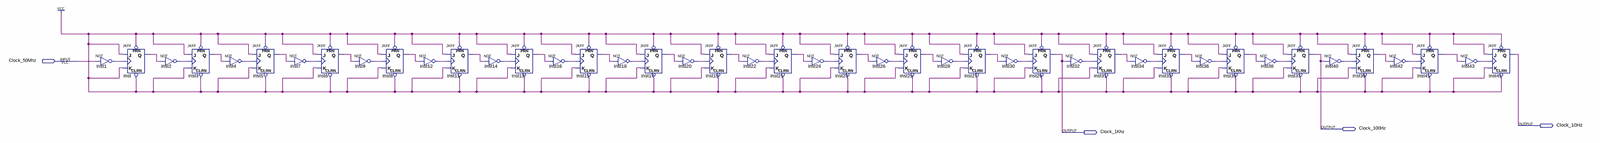
[diagram p0: schematic sheet, whole]
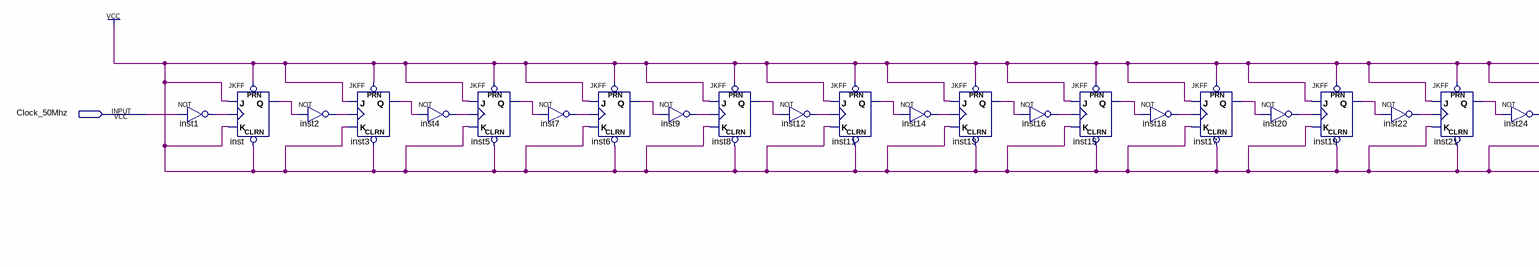
[diagram p1: schematic sheet, left part]
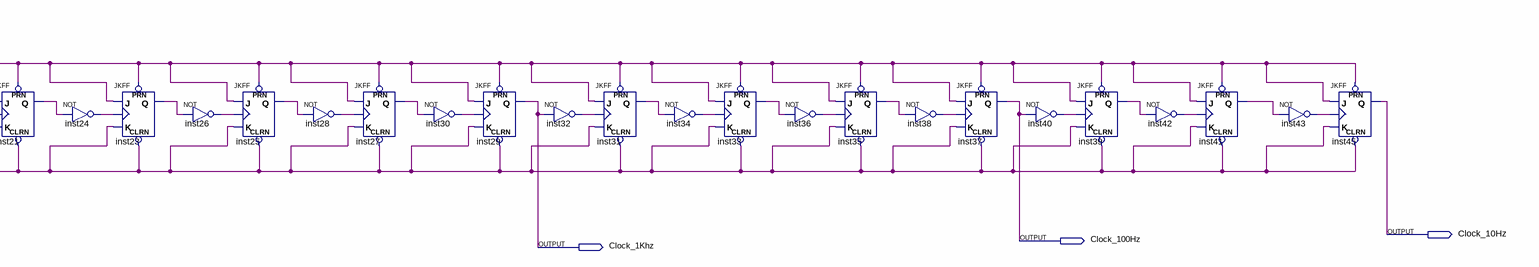
[diagram p2: schematic sheet, right part]
// Quartus schematic Clock.bdf as structural Verilog: 44 symbols, 4 pins
module Clock (
  input  Clock_50Mhz,
  output Clock_10Hz,
  output Clock_100Hz,
  output Clock_1Khz
);

  wire inst1_out, inst2_out, inst3_q, inst4_out, inst5_q, inst6_q, inst7_out, inst8_q, inst9_out, inst11_q,
       inst12_out, inst13_q, inst14_out, inst15_q, inst16_out, inst17_q, inst18_out, inst19_q, inst20_out,
       inst21_q, inst22_out, inst23_q, inst24_out, inst25_q, inst26_out, inst27_q, inst28_out, inst30_out,
       inst31_q, inst32_out, inst33_q, inst34_out, inst35_q, inst36_out, inst38_out, inst39_q, inst40_out,
       inst41_q, inst42_out, inst43_out, inst_q;

  not inst1 (inst1_out, Clock_50Mhz);
  JKFF inst (.PRN(1'b1), .CLRN(1'b1), .K(1'b1), .J(1'b1), .CLK(inst1_out), .Q(inst_q));
  not inst2 (inst2_out, inst_q);
  JKFF inst3 (.PRN(1'b1), .CLRN(1'b1), .K(1'b1), .J(1'b1), .CLK(inst2_out), .Q(inst3_q));
  not inst4 (inst4_out, inst3_q);
  JKFF inst5 (.PRN(1'b1), .CLRN(1'b1), .K(1'b1), .J(1'b1), .CLK(inst4_out), .Q(inst5_q));
  not inst7 (inst7_out, inst5_q);
  JKFF inst6 (.PRN(1'b1), .CLRN(1'b1), .K(1'b1), .J(1'b1), .CLK(inst7_out), .Q(inst6_q));
  not inst9 (inst9_out, inst6_q);
  JKFF inst8 (.PRN(1'b1), .CLRN(1'b1), .K(1'b1), .J(1'b1), .CLK(inst9_out), .Q(inst8_q));
  not inst12 (inst12_out, inst8_q);
  JKFF inst11 (.PRN(1'b1), .CLRN(1'b1), .K(1'b1), .J(1'b1), .CLK(inst12_out), .Q(inst11_q));
  not inst14 (inst14_out, inst11_q);
  JKFF inst13 (.PRN(1'b1), .CLRN(1'b1), .K(1'b1), .J(1'b1), .CLK(inst14_out), .Q(inst13_q));
  not inst16 (inst16_out, inst13_q);
  JKFF inst15 (.PRN(1'b1), .CLRN(1'b1), .K(1'b1), .J(1'b1), .CLK(inst16_out), .Q(inst15_q));
  not inst18 (inst18_out, inst15_q);
  JKFF inst17 (.PRN(1'b1), .CLRN(1'b1), .K(1'b1), .J(1'b1), .CLK(inst18_out), .Q(inst17_q));
  not inst20 (inst20_out, inst17_q);
  JKFF inst19 (.PRN(1'b1), .CLRN(1'b1), .K(1'b1), .J(1'b1), .CLK(inst20_out), .Q(inst19_q));
  not inst22 (inst22_out, inst19_q);
  JKFF inst21 (.PRN(1'b1), .CLRN(1'b1), .K(1'b1), .J(1'b1), .CLK(inst22_out), .Q(inst21_q));
  not inst24 (inst24_out, inst21_q);
  JKFF inst23 (.PRN(1'b1), .CLRN(1'b1), .K(1'b1), .J(1'b1), .CLK(inst24_out), .Q(inst23_q));
  not inst26 (inst26_out, inst23_q);
  JKFF inst25 (.PRN(1'b1), .CLRN(1'b1), .K(1'b1), .J(1'b1), .CLK(inst26_out), .Q(inst25_q));
  not inst28 (inst28_out, inst25_q);
  JKFF inst27 (.PRN(1'b1), .CLRN(1'b1), .K(1'b1), .J(1'b1), .CLK(inst28_out), .Q(inst27_q));
  not inst30 (inst30_out, inst27_q);
  JKFF inst29 (.PRN(1'b1), .CLRN(1'b1), .K(1'b1), .J(1'b1), .CLK(inst30_out), .Q(Clock_1Khz));
  not inst32 (inst32_out, Clock_1Khz);
  JKFF inst31 (.PRN(1'b1), .CLRN(1'b1), .K(1'b1), .J(1'b1), .CLK(inst32_out), .Q(inst31_q));
  not inst34 (inst34_out, inst31_q);
  JKFF inst33 (.PRN(1'b1), .CLRN(1'b1), .K(1'b1), .J(1'b1), .CLK(inst34_out), .Q(inst33_q));
  not inst36 (inst36_out, inst33_q);
  JKFF inst35 (.PRN(1'b1), .CLRN(1'b1), .K(1'b1), .J(1'b1), .CLK(inst36_out), .Q(inst35_q));
  not inst38 (inst38_out, inst35_q);
  JKFF inst37 (.PRN(1'b1), .CLRN(1'b1), .K(1'b1), .J(1'b1), .CLK(inst38_out), .Q(Clock_100Hz));
  not inst40 (inst40_out, Clock_100Hz);
  JKFF inst39 (.PRN(1'b1), .CLRN(1'b1), .K(1'b1), .J(1'b1), .CLK(inst40_out), .Q(inst39_q));
  not inst42 (inst42_out, inst39_q);
  JKFF inst41 (.PRN(1'b1), .CLRN(1'b1), .K(1'b1), .J(1'b1), .CLK(inst42_out), .Q(inst41_q));
  not inst43 (inst43_out, inst41_q);
  JKFF inst45 (.PRN(1'b1), .CLRN(1'b1), .K(1'b1), .J(1'b1), .CLK(inst43_out), .Q(Clock_10Hz));
endmodule
